# EAGLE design AvionicsTestType (EAGLE 7.4.0)
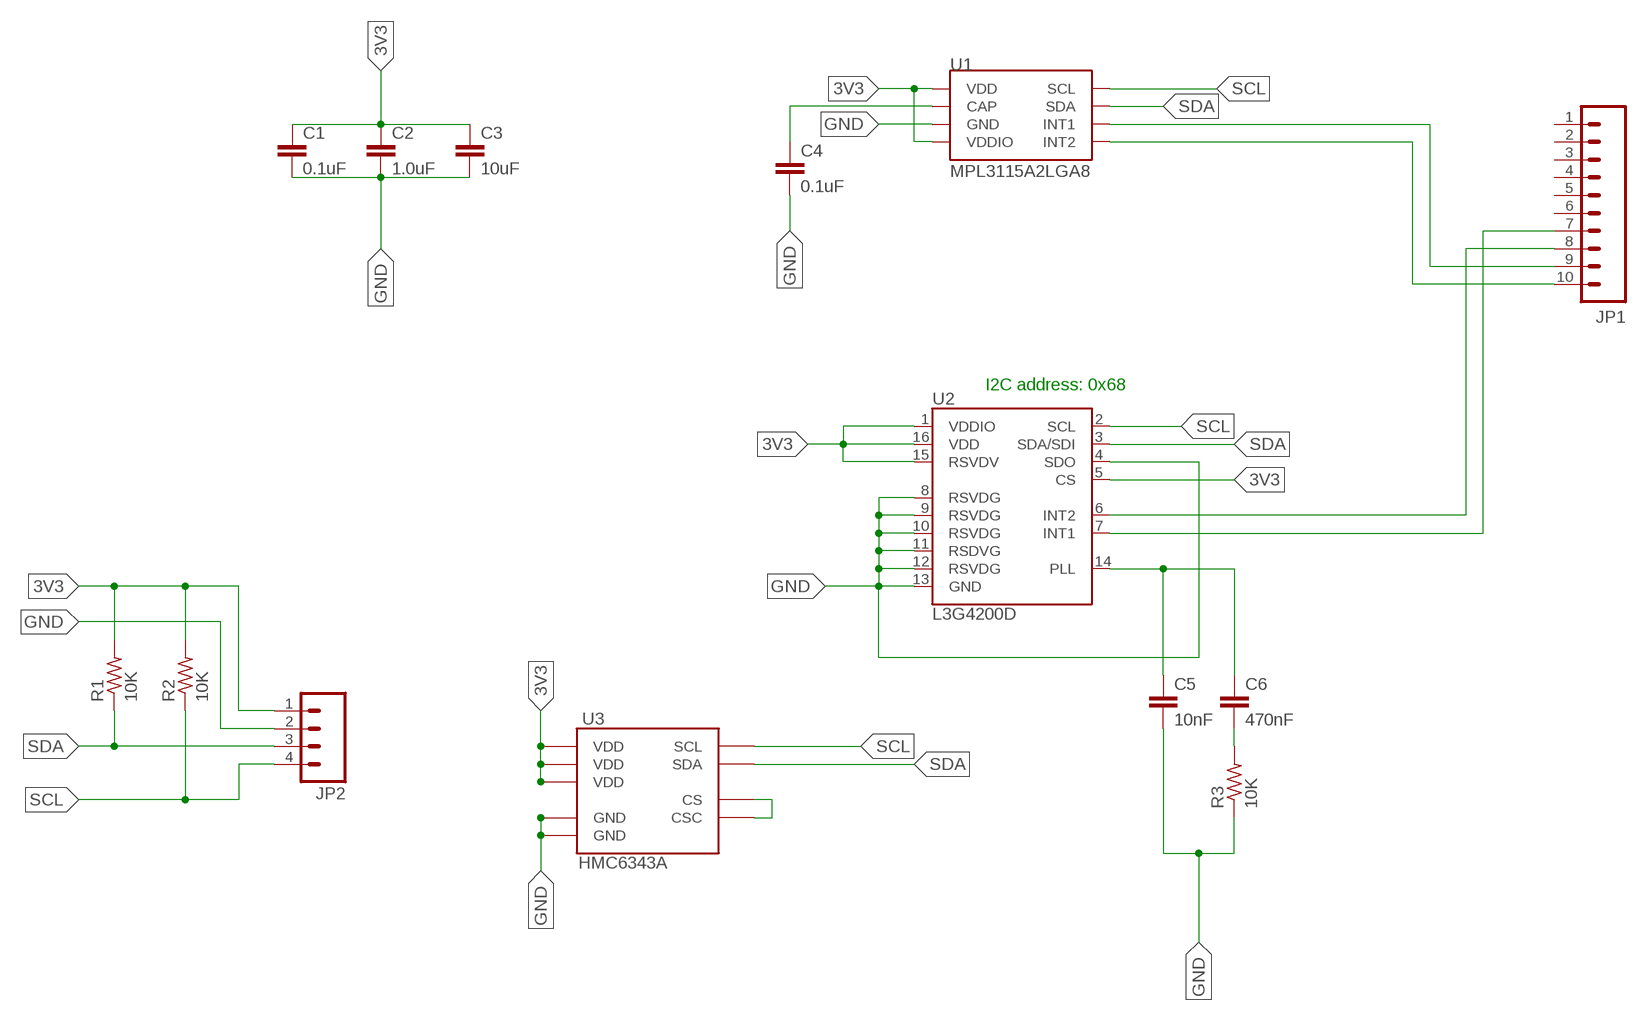
[diagram p0: schematic, sheet 1]

## Parts
C1  0.1uF  0.1UF-25V(+80/-20%)(0603)  [0603-CAP]
C2  1.0uF  1.0UF-25V-+80/-20(0805)"  [0805-CAP]
C3  10uF  1.0UF-25V-+80/-20(0805)"  [0805-CAP]
C4  0.1uF  1.0UF-25V-+80/-20(0805)"  [0805-CAP]
C5  10nF  1.0UF-25V-+80/-20(0805)"  [0805-CAP]
C6  470nF  1.0UF-25V-+80/-20(0805)"  [0805-CAP]
JP1  M10LOCK  [1X10_LOCK]
JP2  M04LOCK  [1X04_LOCK]
R1  10K  R-US_M0805  [M0805]
R2  10K  R-US_M0805  [M0805]
R3  10K  R-US_R0805  [R0805]
U1  MPL3115A2LGA8  [LGA8]
U2  L3G4200D  [LGA16-4X4]
U3  HMC6343A  [LCC36]

## Nets
3V3: C1.1 C2.1 C3.1 JP2.1 R1.2 R2.2 U1.1(VDD) U1.4(VDDIO) U2.1(VDDIO) U2.5(CS) U2.15(RSVDV) U2.16(VDD) U3.3(VDD) U3.11(VDD) U3.21(VDD)
GND: C1.2 C2.2 C3.2 C4.2 C5.2 JP2.2 R3.1 U1.3(GND) U2.4(SDO) U2.8(RSVDG) U2.9(RSVDG) U2.10(RSVDG) U2.11(RSDVG) U2.12(RSVDG) U2.13(GND) U3.25(GND) U3.29(GND)
N$1: JP1.10 U1.5(INT2)
N$2: U3.22(CS) U3.35(CSC)
N$3: JP1.9 U1.6(INT1)
N$4: JP1.7 U2.7(INT1)
N$5: JP1.8 U2.6(INT2)
N$6: C4.1 U1.2(CAP)
N$7: C6.2 R3.2
N$8: C5.1 C6.1 U2.14(PLL)
SCL: JP2.4 R2.1 U1.8(SCL) U2.2(SCL) U3.32(SCL)
SDA: JP2.3 R1.1 U1.7(SDA) U2.3(SDA/SDI) U3.36(SDA)
Unconnected: JP1.1 JP1.2 JP1.3 JP1.4 JP1.5 JP1.6

## Notes on the sheet
- I2C address: 0x68

## Library data of the parts
C1 = SparkFun-Capacitors:0.1UF-25V(+80/-20%)(0603): CAP-00810 Ceramic Standard decoupling cap; PROD_ID: CAP-00810
C2 = SparkFun-Capacitors:1.0UF-25V-+80/-20(0805): CAP-11625; PROD_ID: CAP-11625
C3-C6 = SparkFun-Capacitors:1.0UF-25V-+80/-20(0805): CAP-11625; PROD_ID: CAP-11625; VALUE: 1.0uF
JP1 = SparkFun-Connectors:M10: Header 10 Standard 10-pin 0.1" header. Use with straight break away headers (SKU : PRT-00116), right angle break away headers (PRT-00553), swiss pins (PRT-00743), machine pins (PRT-00117), and female headers (PRT-00115).
JP2 = SparkFun-Connectors:M04: Header 4 Standard 4-pin 0.1" header. Use with straight break away headers (SKU : PRT-00116), right angle break away headers (PRT-00553), swiss pins (PRT-00743), machine pins (PRT-00117), and female headers (PRT-00115). Molex polarized connector foot print use with SKU : PRT-08231 with associated crimp pins and housings. 1MM SMD Version SKU: PRT-10208
R1-R3 = resistor:R-US_: RESISTOR, American symbol
U1 = SparkFun-Sensors:MPL3115A2: Altimeter/Pressure Sensor, I2C, 1.95V-3.6V supply, 50 to 110kPa; PROD_ID: IC-10869
U2 = SparkFun-Sensors:L3G4200D: L3G4200D Three-axis, digital output gyroscope The L3G4200D is a low-power three-axis angular rate sensor, has a full scale of ±250/±500/±2000 dps and is capable of measuring rates with a user-selectable bandwidth. It includes a sensing element and an IC interface capable of providing the measured angular rate to the external world through a digital interface (I2C/SPI). Package: 4x4x1.1 LGA-16 (LGA16-4x4.PAC)
U3 = SparkFun-Sensors:HMC6343: Honeywell compass IC with tilt compensation, SEN-08656

## Board
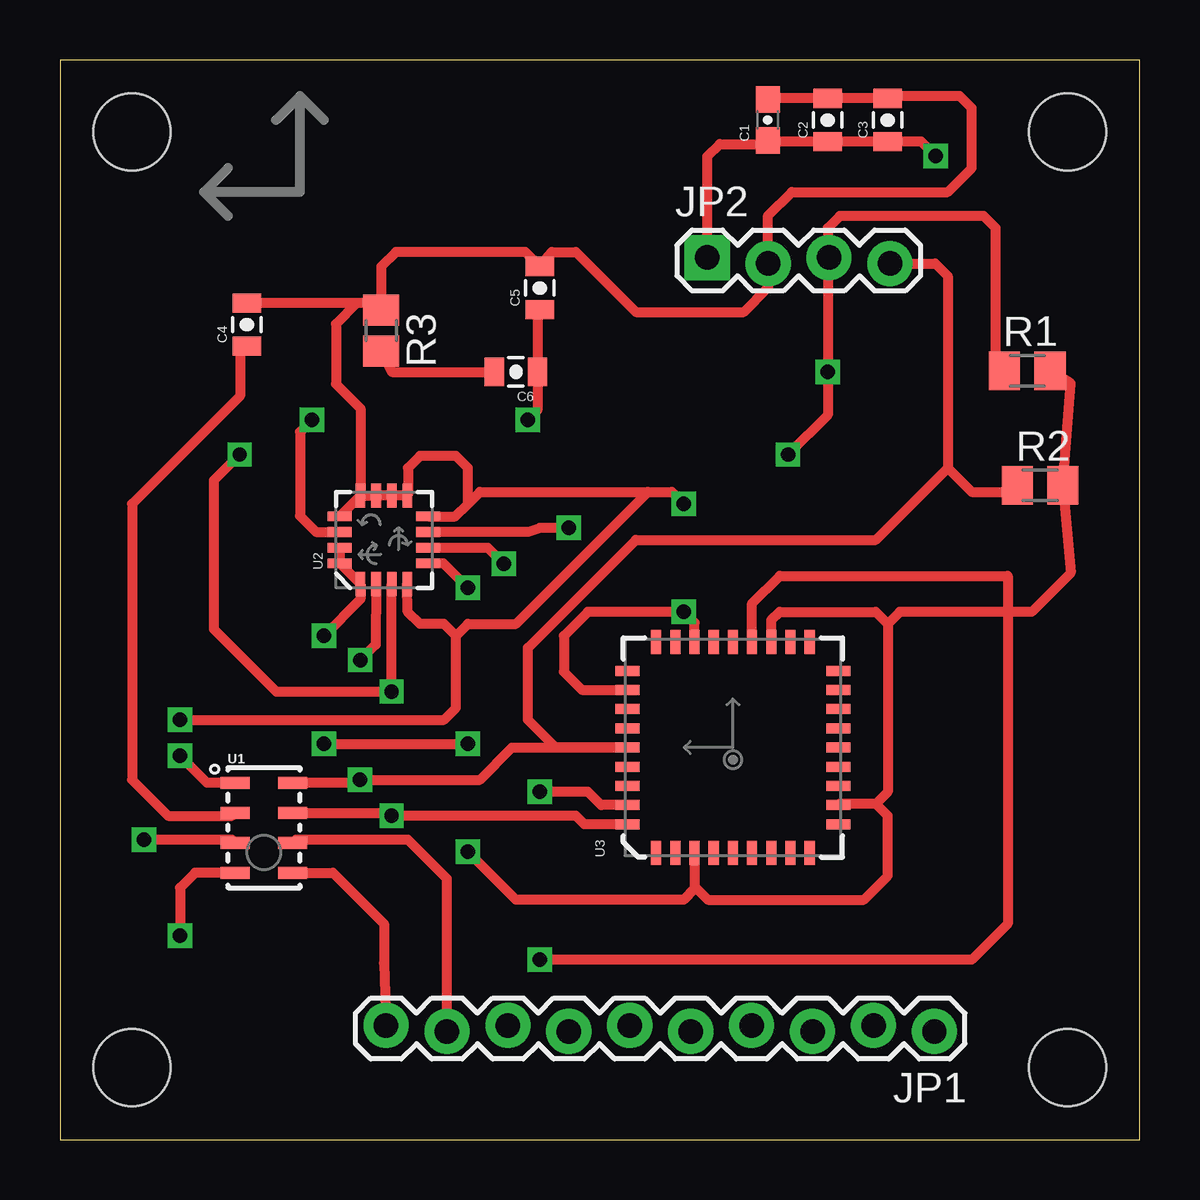
[diagram p1: board, top side]
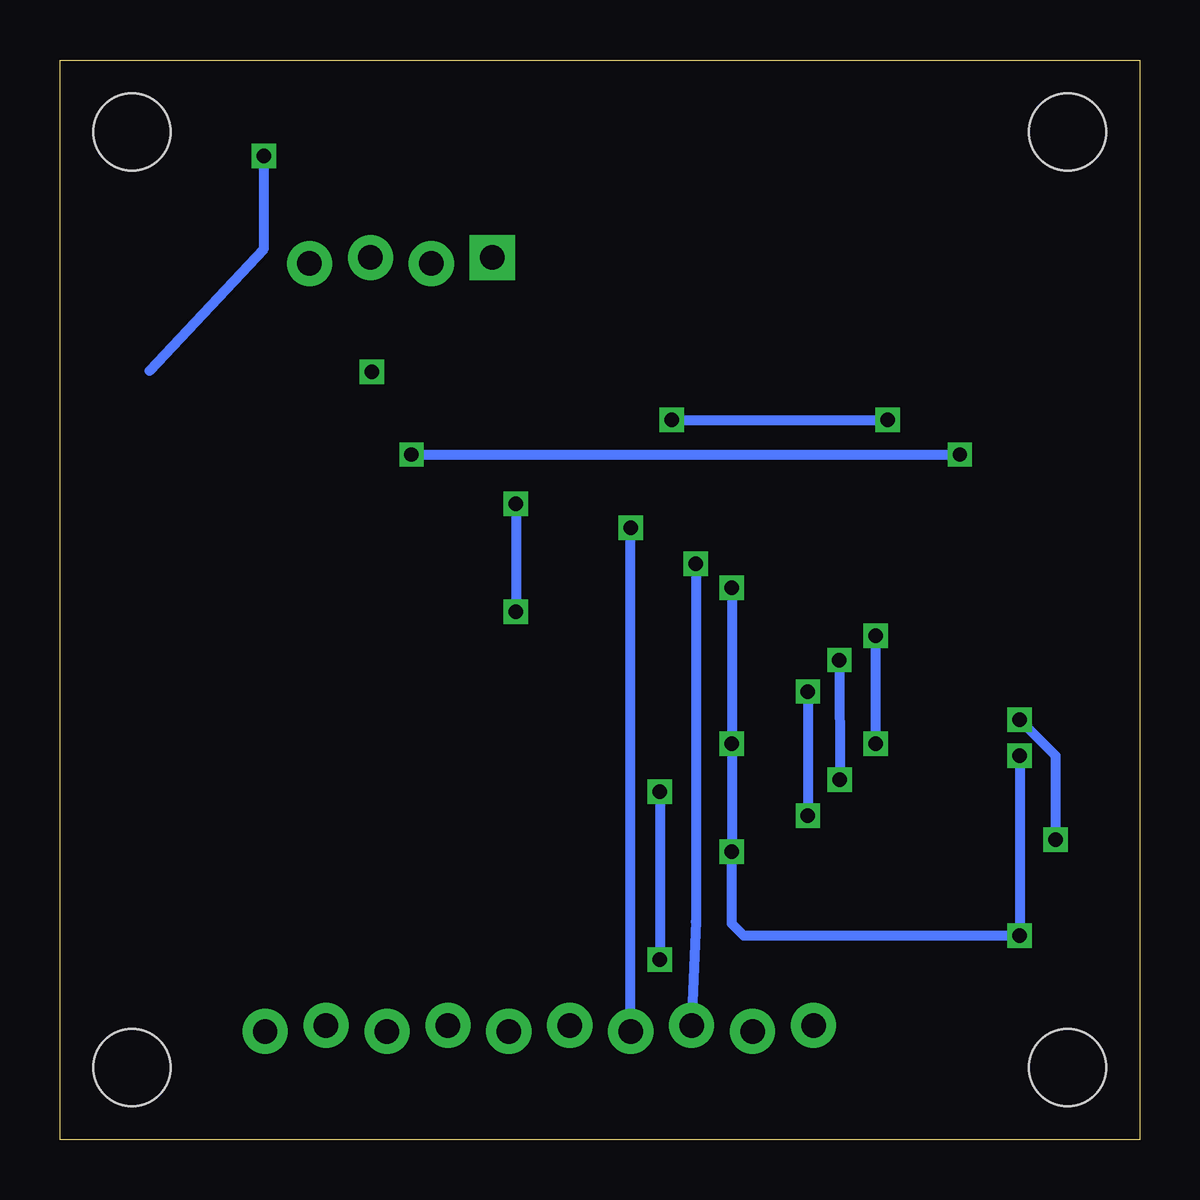
[diagram p2: board, bottom side, seen from below]

Size 45 x 45 mm. Coordinates in mm from the lower left corner, seen from the top.
Outline: 0,0 45,0 45,45 0,45 0,0
Copper layers (1*16): Top 0.035mm / dielectric 1.5mm / Bottom 0.035mm
Design rules "default": minimum track width 10mil, minimum drill 24mil, track to track 8mil, track to pad 8mil, pad to pad 8mil, via to via 8mil, smd to smd 8mil, copper to edge 40mil, drill to drill 8mil, minimum pad ring 10mil, minimum via ring 8mil, stop-mask expansion 4mil, vias tented up to drill 0mil, thermal gap 10mil
Holes 3.2 mm at 3,3 42,3 42,42 3,42

### Footprints (pad centres in the part's own frame; a part is rotated, then mirrored left to right if it is on the bottom)
0603-CAP = smd 1.1 x 1: 1 -0.85,0; 2 0.85,0
0805-CAP = smd 0.8 x 1.2: 1 -0.9,0; 2 0.9,0
1X10_LOCK = drill 1.016 pad 1.88: 1 0,0.127; 2 2.54,-0.127; 3 5.08,0.127; 4 7.62,-0.127; 5 10.16,0.127; 6 12.7,-0.127; 7 15.24,0.127; 8 17.78,-0.127; 9 20.32,0.127; 10 22.86,-0.127
1X04_LOCK = drill 1.016 pad 1.88 square: 1 0,0.127 | drill 1.016 pad 1.88: 2 2.54,-0.127; 3 5.08,0.127; 4 7.62,-0.127
M0805 = smd 1.3 x 1.6: 1 -0.95,0; 2 0.95,0
R0805 = smd 1.3 x 1.5: 1 -0.85,0; 2 0.85,0
LGA8 = smd 1.2 x 0.5: 1 -1.2,1.875; 2 -1.2,0.625; 3 -1.2,-0.625; 4 -1.2,-1.875; 5 1.2,-1.875; 6 1.2,-0.625; 7 1.2,0.625; 8 1.2,1.875
LGA16-4X4 = smd 1 x 0.4: 1 -1.85,0.975; 2 -1.85,0.325; 3 -1.85,-0.325; 4 -1.85,-0.975; 9 1.85,-0.975; 10 1.85,-0.325; 11 1.85,0.325; 12 1.85,0.975 | smd 0.4 x 1: 5 -0.975,-1.85; 6 -0.325,-1.85; 7 0.325,-1.85; 8 0.975,-1.85; 13 0.975,1.85; 14 0.325,1.85; 15 -0.325,1.85; 16 -0.975,1.85
LCC36 = smd 1 x 0.42: 1 -4.4,3.2; 2 -4.4,2.4; 3 -4.4,1.6; 4 -4.4,0.8; 5 -4.4,0; 6 -4.4,-0.8; 7 -4.4,-1.6; 8 -4.4,-2.4; 9 -4.4,-3.2; 19 4.4,-3.2; 20 4.4,-2.4; 21 4.4,-1.6; 22 4.4,-0.8; 23 4.4,0; 24 4.4,0.8; 25 4.4,1.6; 26 4.4,2.4; 27 4.4,3.2 | smd 0.42 x 1: 10 -3.2,-4.4; 11 -2.4,-4.4; 12 -1.6,-4.4; 13 -0.8,-4.4; 14 0,-4.4; 15 0.8,-4.4; 16 1.6,-4.4; 17 2.4,-4.4; 18 3.2,-4.4; 28 3.2,4.4; 29 2.4,4.4; 30 1.6,4.4; 31 0.8,4.4; 32 0,4.4; 33 -0.8,4.4; 34 -1.6,4.4; 35 -2.4,4.4; 36 -3.2,4.4

### Placement (x,y rotation side)
C1  29.5,42.5 90 top
C2  32,42.5 90 top
C3  34.5,42.5 90 top
C4  7.79,33.97 90 top
C5  20,35.5 90 top
C6  19,32 180 top
JP1  36.45,4.63 180 top
JP2  26.98,36.64 0 top
R1  40.32,32.05 0 top
R2  40.85,27.27 0 top
R3  13.39,33.72 270 top
U1  8.5,13 0 top
U2  13.5,25 90 top
U3  28.05,16.34 90 top

### Tracks (layer width: path | path; a pad name or v marks a point on that pad's centre or on a via)
3V3  (via drill 0.6)
  Top 0.406: 34,14 34.5,13.5 34.5,11 33.5,10 27,10 26.45,10.55 U3.3 26.45,10.45 26,10 19,10 v17,12 | 34,14 32.51,14 U3.11 | U3.21 29.65,21.65 30,22 34,22 34.5,21.5 | 34.5,21.5 34.5,14.5 34,14 | 34.5,21.5 35,22 40.5,22 42.12,23.62 R2.2 42.12,31.52 R1.2 | 32.08,41.63 C2.1 | JP2.1 26.98,40.98 27.5,41.5 29.35,41.5 C1.1 29.55,41.6 C2.1 | C2.1 C3.1 35.9,41.6 v36.5,41 | U2.5 15.97,24.02 v17,23 | U1.4 5.62,11.12 5,10.5 v5,8.5 | U1.1 6.12,14.88 v5,16 | U2.15 U2.16 U2.1 12.53,22.52 v11,21 | v11,16.5 v17,16.5
  Bottom 0.406: v17,23 v17,16.5 v17,12 17,9 16.5,8.5 v5,8.5 v5,16 | R1.2 36.5,37.14 v36.5,41 | v11,16.5 v11,21
GND  (via drill 0.6)
  Top 0.406: 32.08,43.44 C2.2 | C2.2 C3.2 34.6,43.5 37.5,43.5 38,43 38,40.5 37,39.5 30.5,39.5 29.52,38.52 JP2.2 29.52,35.52 28.5,34.5 24,34.5 21.5,37 20.5,37 C5.2 19.4,37 14,37 13.39,36.39 R3.1 13.27,34.87 12.37,34.87 | C2.2 29.55,43.4 C1.2 | 12.37,34.87 C4.2 | 12.37,34.87 11.5,34 11.5,31.5 12.53,30.48 U2.12 | U2.8 16.48,25.98 17,26.5 | 17,26.5 17,28 16.5,28.5 15,28.5 14.5,28 14.5,26.88 U2.9 U2.10 U2.11 U2.12 | U2.12 U2.13 | U3.25 26.45,21.55 v26,22 22,22 21,21 21,19.5 21.76,18.74 U3.29 | 17,26.5 17.5,27 24.5,27 | 24.5,27 25.5,27 v26,26.5 | U1.3 7.17,12.5 v3.5,12.5 | v5,17.5 16,17.5 16.5,18 16.5,21 | 16.5,21 16,21.5 15,21.5 14.49,22 14.46,23.12 U2.4 | 16.5,21 17,21.5 19,21.5 24.5,27
  Bottom 0.406: v26,26.5 v26,22 | v3.5,12.5 3.5,16 v5,17.5
N$1
  Top 0.406: U1.5 11.38,11.12 13.5,9 13.5,7.35 JP1.10
N$2  (via drill 0.6)
  Top 0.406: U3.22 28.85,22.35 30,23.5 39.5,23.5 39.5,9 38,7.5 v20,7.5 | U3.35 22.56,13.94 22,14.5 v20,14.5
  Bottom 0.406: v20,14.5 v20,7.5
N$3
  Top 0.406: JP1.9 16.13,10.87 14.5,12.5 9.82,12.5 U1.6
N$4  (via drill 0.6)
  Top 0.406: v21.21,25.5 20,25.5 19.5,25.32 U2.7
  Bottom 0.406: JP1.7 v21.21,25.5
N$5  (via drill 0.6)
  Top 0.406: U2.6 17.82,24.68 v18.5,24
  Bottom 0.406: v18.5,24 18.5,9.09 JP1.8
N$6
  Top 0.406: C4.1 7.5,32.77 7.5,31 3,26.5 3,15 4.5,13.5 7.17,13.5 U1.2
N$7
  Top 0.406: R3.2 13.84,32 C6.2
N$8  (via drill 0.6)
  Top 0.406: C5.1 19.9,34.5 C6.1 19.9,30.4 v19.5,30 | v10.5,30 10,29.5 10,26 10.68,25.32 U2.14
  Bottom 0.406: v19.5,30 v10.5,30
N$9  (via drill 0.6)
  other vias: 32,32
SCL  (via drill 0.6)
  Top 0.406: JP2.4 36.49,36.51 37,36 37,28 | 37,28 38,27 39.32,27 R2.1 | U2.2 13.16,20.63 v12.52,19.98 | U1.8 12.38,14.88 v12.5,15 17.5,15 18.84,16.34 U3.32 20.66,16.34 19.5,17.5 19.5,20.5 24,25 34,25 37,28
  Bottom 0.406: v12.52,19.98 v12.5,15
SDA  (via drill 0.6)
  Top 0.406: R1.1 39,32 39,38 38.5,38.5 32.5,38.5 32,38 32,36.83 JP2.3 32.06,36.56 32,36.5 32,32.05 | U1.7 13.7,13.62 arc-90 v13.82,13.5 21.5,13.5 21.86,13.14 U3.36 | 32,32.05 32.02,32.03 | 32,32.05 32,30.2 v30.35,28.55 | v7.49,28.55 6.42,27.48 6.42,21.28 9.02,18.68 v13.82,18.68 U2.3
  Bottom 0.406: v13.82,18.68 v13.82,13.5 | v30.35,28.55 v7.49,28.55

### Text on the board
tDocu: x | y